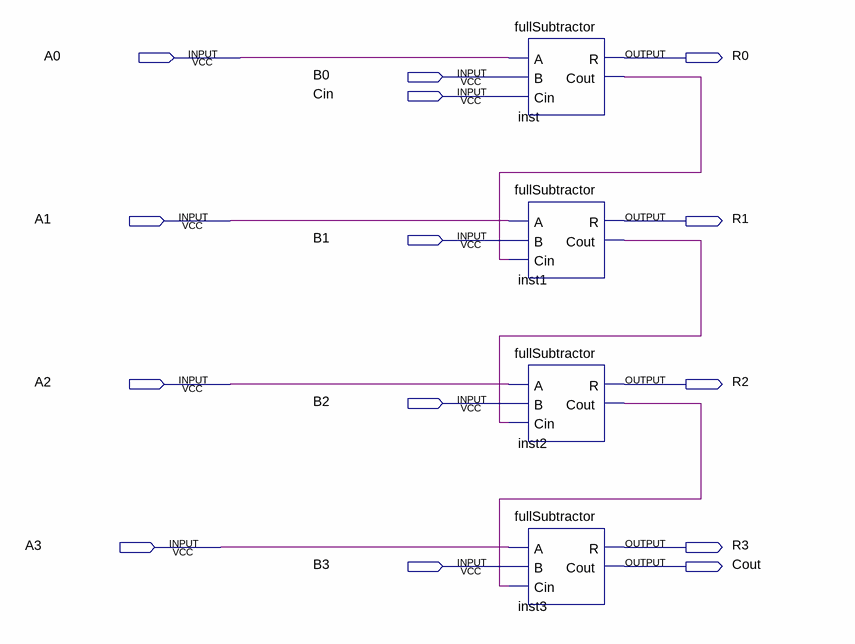
[diagram p0: schematic sheet]
// Quartus schematic fullSubtractor4.bdf as structural Verilog: 4 symbols, 14 pins
module fullSubtractor4 (
  input  A0,
  input  B0,
  input  Cin,
  input  A1,
  input  B1,
  input  A2,
  input  B2,
  input  A3,
  input  B3,
  output R0,
  output R1,
  output R2,
  output R3,
  output Cout
);

  wire inst1_cout, inst2_cout, inst_cout;

  fullSubtractor inst (.A(A0), .B(B0), .Cin(Cin), .R(R0), .Cout(inst_cout));
  fullSubtractor inst1 (.A(A1), .B(B1), .Cin(inst_cout), .R(R1), .Cout(inst1_cout));
  fullSubtractor inst2 (.A(A2), .B(B2), .Cin(inst1_cout), .R(R2), .Cout(inst2_cout));
  fullSubtractor inst3 (.A(A3), .B(B3), .Cin(inst2_cout), .R(R3), .Cout(Cout));
endmodule
